# Altium project Projeto_DAC_Raspberry.PrjPcb (part 1 of 2)
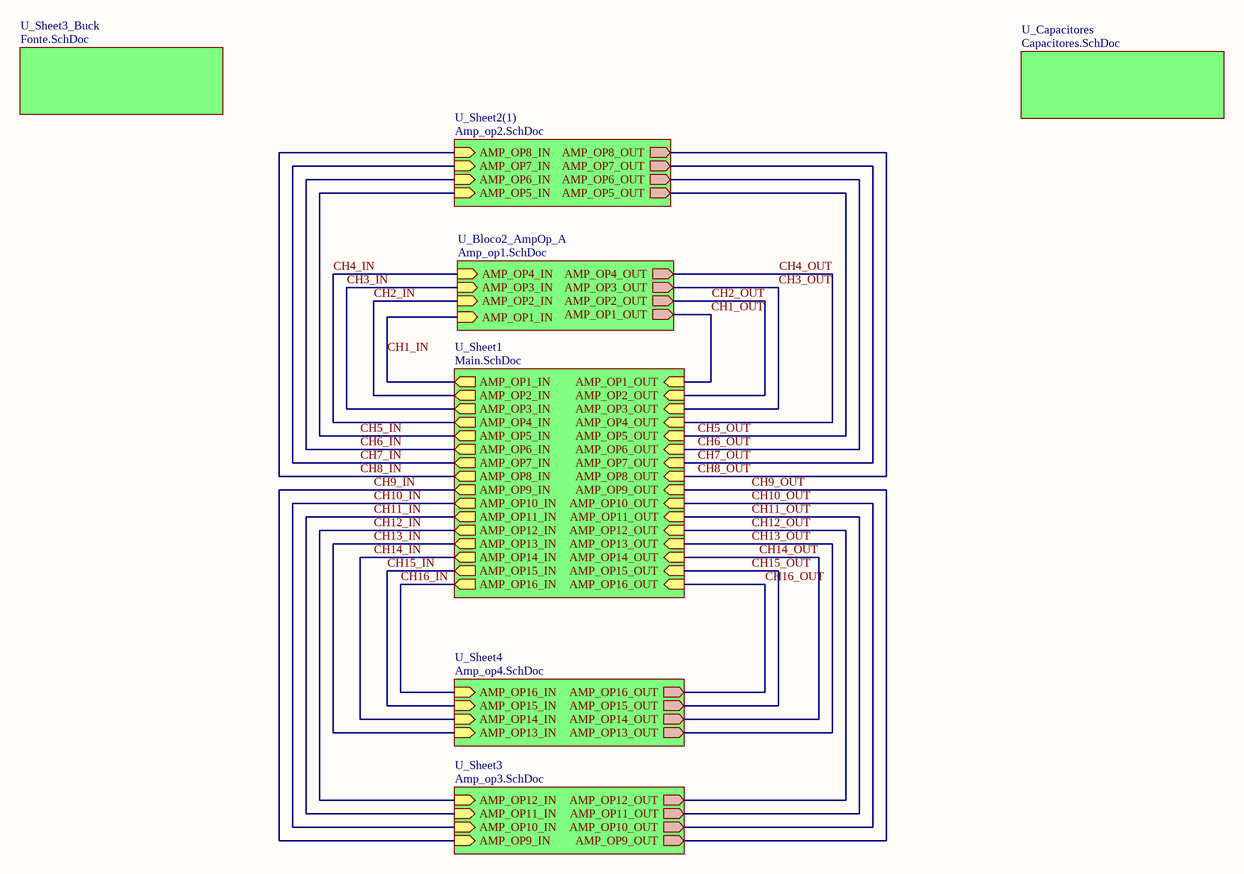
[diagram p0: Hierarquia.SchDoc]
8 sheets, 197 parts. Net scope: global (net labels, ports and power ports of the same name join across sheets).
Board file: RaspberryHatBoard1.PcbDoc
Sheets:
  Hierarquia.SchDoc
    U_Sheet3_Buck = fonte.SchDoc
    U_Bloco2_AmpOp_A = Amp_op1.SchDoc
    U_Sheet1 = Main.SchDoc
    U_Sheet2(1) = Amp_op2.SchDoc
    U_Sheet3 = Amp_op3.SchDoc
    U_Sheet4 = Amp_op4.SchDoc
    U_Capacitores = Capacitores.SchDoc

## Sheet Hierarquia.SchDoc: Hierarquia
size A3; Address1: UFCG; Address2: Laboratório VIRTUS CC; Address3: Campina Grande, PB - Brasil; SheetNumber: 1; SheetTotal: 8; Project: HAT RPi 4 - Phase Shifter Fotônico; DocumentRev: 01; Version: v1.0; SCH_SCALE: N/A

### Sub-sheets
U_Bloco2_AmpOp_A = Amp_op1.SchDoc: AMP_OP4_IN (in), AMP_OP3_IN (in), AMP_OP2_IN (in), AMP_OP1_IN (in), AMP_OP1_OUT (out), AMP_OP2_OUT (out), AMP_OP3_OUT (out), AMP_OP4_OUT (out)
U_Capacitores = Capacitores.SchDoc: no entries
U_Sheet1 = Main.SchDoc: AMP_OP1_IN (out), AMP_OP2_IN (out), AMP_OP3_IN (out), AMP_OP4_IN (out), AMP_OP1_OUT (in), AMP_OP2_OUT (in), AMP_OP3_OUT (in), AMP_OP4_OUT (in), AMP_OP5_IN (out), AMP_OP6_IN (out), AMP_OP7_IN (out), AMP_OP8_IN (out), AMP_OP5_OUT (in), AMP_OP6_OUT (in), AMP_OP7_OUT (in), AMP_OP8_OUT (in), AMP_OP9_IN (out), AMP_OP10_IN (out), AMP_OP11_IN (out), AMP_OP12_IN (out), AMP_OP13_IN (out), AMP_OP14_IN (out), AMP_OP15_IN (out), AMP_OP16_IN (out), AMP_OP9_OUT (in), AMP_OP10_OUT (in), AMP_OP11_OUT (in), AMP_OP12_OUT (in), AMP_OP13_OUT (in), AMP_OP14_OUT (in), AMP_OP15_OUT (in), AMP_OP16_OUT (in)
U_Sheet2(1) = Amp_op2.SchDoc: AMP_OP7_OUT (out), AMP_OP5_OUT (out), AMP_OP6_OUT (out), AMP_OP8_OUT (out), AMP_OP5_IN (in), AMP_OP6_IN (in), AMP_OP7_IN (in), AMP_OP8_IN (in)
U_Sheet3 = Amp_op3.SchDoc: AMP_OP9_OUT (out), AMP_OP10_OUT (out), AMP_OP12_OUT (out), AMP_OP9_IN (in), AMP_OP10_IN (in), AMP_OP11_IN (in), AMP_OP12_IN (in), AMP_OP11_OUT (out)
U_Sheet3_Buck = Fonte.SchDoc: no entries
U_Sheet4 = Amp_op4.SchDoc: AMP_OP16_OUT (out), AMP_OP13_OUT (out), AMP_OP15_OUT (out), AMP_OP14_OUT (out), AMP_OP13_IN (in), AMP_OP14_IN (in), AMP_OP15_IN (in), AMP_OP16_IN (in)

### Nets
CH1_IN: sheet U_Bloco2_AmpOp_A/AMP_OP1_IN, sheet U_Sheet1/AMP_OP1_IN
CH1_OUT: sheet U_Bloco2_AmpOp_A/AMP_OP1_OUT, sheet U_Sheet1/AMP_OP1_OUT
CH2_IN: sheet U_Bloco2_AmpOp_A/AMP_OP2_IN, sheet U_Sheet1/AMP_OP2_IN
CH2_OUT: sheet U_Bloco2_AmpOp_A/AMP_OP2_OUT, sheet U_Sheet1/AMP_OP2_OUT
CH3_IN: sheet U_Bloco2_AmpOp_A/AMP_OP3_IN, sheet U_Sheet1/AMP_OP3_IN
CH3_OUT: sheet U_Bloco2_AmpOp_A/AMP_OP3_OUT, sheet U_Sheet1/AMP_OP3_OUT
CH4_IN: sheet U_Bloco2_AmpOp_A/AMP_OP4_IN, sheet U_Sheet1/AMP_OP4_IN
CH4_OUT: sheet U_Bloco2_AmpOp_A/AMP_OP4_OUT, sheet U_Sheet1/AMP_OP4_OUT
CH5_IN: sheet U_Sheet1/AMP_OP5_IN, sheet U_Sheet2(1)/AMP_OP5_IN
CH5_OUT: sheet U_Sheet1/AMP_OP5_OUT, sheet U_Sheet2(1)/AMP_OP5_OUT
CH6_IN: sheet U_Sheet1/AMP_OP6_IN, sheet U_Sheet2(1)/AMP_OP6_IN
CH6_OUT: sheet U_Sheet1/AMP_OP6_OUT, sheet U_Sheet2(1)/AMP_OP6_OUT
CH7_IN: sheet U_Sheet1/AMP_OP7_IN, sheet U_Sheet2(1)/AMP_OP7_IN
CH7_OUT: sheet U_Sheet1/AMP_OP7_OUT, sheet U_Sheet2(1)/AMP_OP7_OUT
CH8_IN: sheet U_Sheet1/AMP_OP8_IN, sheet U_Sheet2(1)/AMP_OP8_IN
CH8_OUT: sheet U_Sheet1/AMP_OP8_OUT, sheet U_Sheet2(1)/AMP_OP8_OUT
CH9_IN: sheet U_Sheet1/AMP_OP9_IN, sheet U_Sheet3/AMP_OP9_IN
CH9_OUT: sheet U_Sheet1/AMP_OP9_OUT, sheet U_Sheet3/AMP_OP9_OUT
CH10_IN: sheet U_Sheet1/AMP_OP10_IN, sheet U_Sheet3/AMP_OP10_IN
CH10_OUT: sheet U_Sheet1/AMP_OP10_OUT, sheet U_Sheet3/AMP_OP10_OUT
CH11_IN: sheet U_Sheet1/AMP_OP11_IN, sheet U_Sheet3/AMP_OP11_IN
CH11_OUT: sheet U_Sheet1/AMP_OP11_OUT, sheet U_Sheet3/AMP_OP11_OUT
CH12_IN: sheet U_Sheet1/AMP_OP12_IN, sheet U_Sheet3/AMP_OP12_IN
CH12_OUT: sheet U_Sheet1/AMP_OP12_OUT, sheet U_Sheet3/AMP_OP12_OUT
CH13_IN: sheet U_Sheet1/AMP_OP13_IN, sheet U_Sheet4/AMP_OP13_IN
CH13_OUT: sheet U_Sheet1/AMP_OP13_OUT, sheet U_Sheet4/AMP_OP13_OUT
CH14_IN: sheet U_Sheet1/AMP_OP14_IN, sheet U_Sheet4/AMP_OP14_IN
CH14_OUT: sheet U_Sheet1/AMP_OP14_OUT, sheet U_Sheet4/AMP_OP14_OUT
CH15_IN: sheet U_Sheet1/AMP_OP15_IN, sheet U_Sheet4/AMP_OP15_IN
CH15_OUT: sheet U_Sheet1/AMP_OP15_OUT, sheet U_Sheet4/AMP_OP15_OUT
CH16_IN: sheet U_Sheet1/AMP_OP16_IN, sheet U_Sheet4/AMP_OP16_IN
CH16_OUT: sheet U_Sheet1/AMP_OP16_OUT, sheet U_Sheet4/AMP_OP16_OUT

### Notes on the sheet
- REVISION
- DESCRIPTION
- DATE
- APPROVED
- ADDRESS
- PROJECT
- VERSION
- TITLE
- A3
- SIZE
- SCALE
- DOCUMENT NAME:
- DOCUMENT REVISION:
- OF
- SHEET:
- PROJECT REVISION:

## Sheet fonte.SchDoc: Fonte
size A3; Address1: UFCG; Address2: Laboratório VIRTUS CC; Address3: Campina Grande, PB - Brasil; SheetNumber: 3; SheetTotal: 8; Project: HAT RPi 4 - Phase Shifter Fotônico; DocumentRev: 01; SCH_SCALE: N/A; Version: v1.0
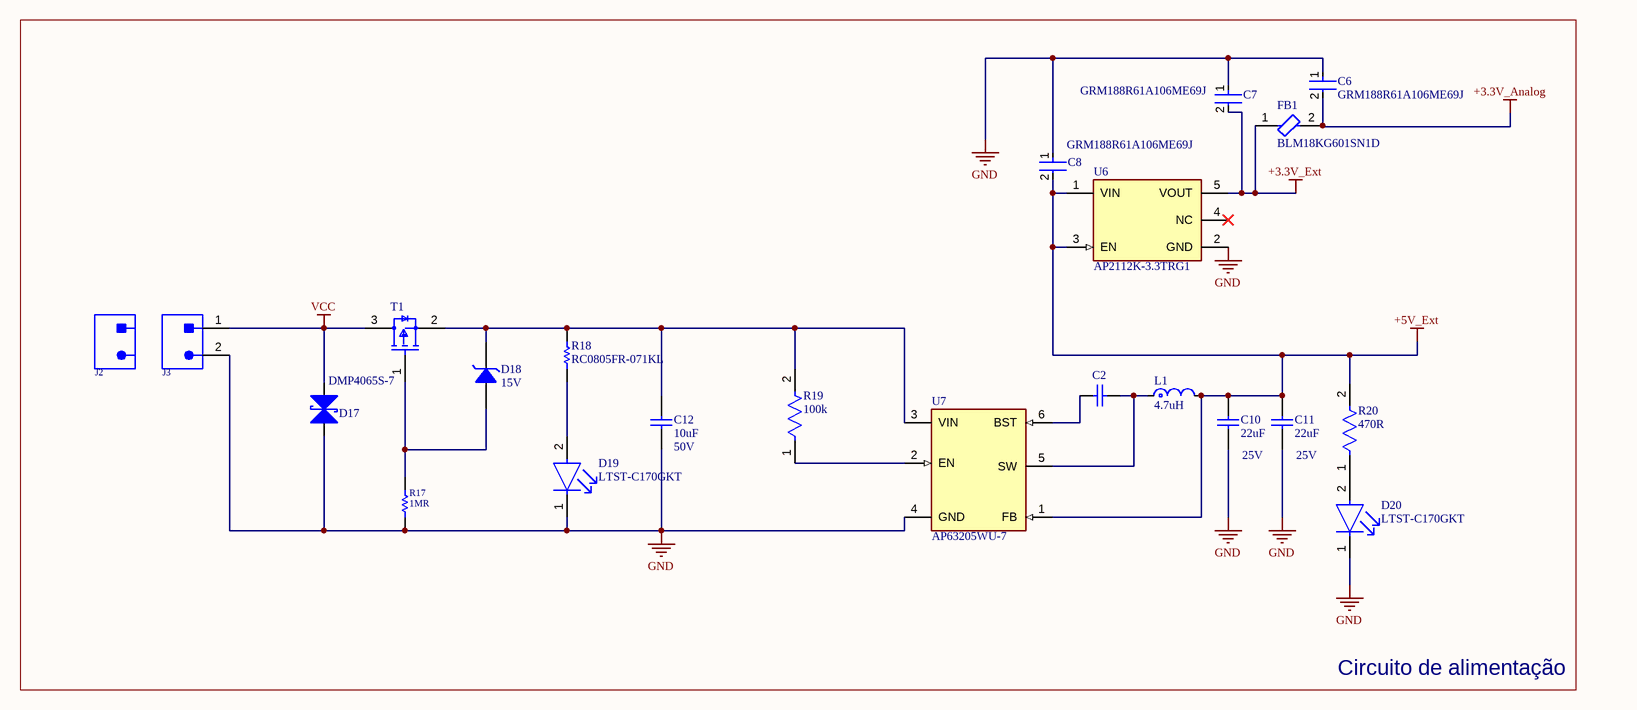
[diagram p1: fonte.SchDoc]

### Parts
C2  VJ0603Y104MXJCW1BC  [CAPC1608X95X40NL15T15]  (value not drawn)
C6  GRM188R61A106ME69J  [FP-GRM188-0_15-IPC_C]
C7  GRM188R61A106ME69J  [FP-GRM188-0_15-IPC_C]
C8  GRM188R61A106ME69J  [FP-GRM188-0_15-IPC_C]
C10  value 22uF  Voltage Rating (DC): 25V  [C-0805]  (hidden comment: CL21A226MAYNNNE)
C11  value 22uF  Voltage Rating: 25V  [C-0805]  (hidden comment: CL21A226MAYNNNE)
C12  value 10uF  Voltage Rating (DC): 50V  [C-1206]  (hidden comment: CL31A106KBHNNNE)
D17  SMBJ28CAQ-13-F  [DO-214AA]  (value not drawn)
D18  Zener Voltage: 15V  [SOD-123]  (hidden comment: MMSZ5245B-TP)
D19  LTST-C170GKT  [FP-LTST-C170GKT-MFG]
D20  LTST-C170GKT  [FP-LTST-C170GKT-MFG]
FB1  BLM18KG601SN1D  [FP-BLM18-0_15-t0_8-IPC_A]
J2  5447861  [5447861]  (value not drawn)
J3  5444262  [5444262]  (value not drawn)
L1  value 4.7uH  [FP-DG6045C-MFG]  (hidden comment: 1255AY-4R7M=P3)
R17  value 1MR  [R-0805]  (hidden comment: RC0805FR-071ML)
R18  RC0805FR-071KL  [RESC2013X60X35ML10T20]
R19  100k  [FP-CRGCQ0805-IPC_C]
R20  470R  [FP-CRGCQ0805-IPC_C]
T1  DMP4065S-7  [FP-SOT23-MFG]
U6  AP2112K-3.3TRG1  [FP-SOT25-IPC_A]
U7  AP63205WU-7  [TSOT-23-6_A]

### Blocks framed on the sheet
Circuito de alimentação: C2 C6-C8 C10-C12 D17-D20 FB1 J2 J3 L1 R17-R20 T1 U6 U7

### Nets
+3.3V_Analog: C6.2 FB1.2
+3.3V_Ext: C7.2 FB1.1 U6.5(VOUT)
+5V_Ext: C8.2 C10.1 C11.1 L1.2 R20.2 U6.1(VIN) U6.3(EN) U7.1(FB)
GND: C6.1 C7.1 C8.1 C10.2 C11.2 C12.2 D17.2(Anode) D19.1(C) D20.1(C) J3.2 R17.1 U6.2(GND) U7.4(GND)
VCC: D17.1(Cathode) J3.1 T1.3(D)
NetC2_1: C2.1 U7.6(BST)
NetC2_2: C2.2 L1.1 U7.5(SW)
NetC12_1: C12.1 D18.1(K) R18.2 R19.2 T1.2(S) U7.3(VIN)
NetD18_2: D18.2(A) R17.2 T1.1(G)
NetD19_2: D19.2(A) R18.1
NetD20_2: D20.2(A) R20.1
NetR19_1: R19.1 U7.2(EN)

Not connected (* = marked no-connect by the designer): U6 4(NC)*

### Notes on the sheet
- REVISION
- DESCRIPTION
- DATE
- APPROVED
- ADDRESS
- PROJECT
- VERSION
- TITLE
- A3
- SIZE
- SCALE
- DOCUMENT NAME:
- DOCUMENT REVISION:
- OF
- SHEET:
- PROJECT REVISION:

### Library data of the parts
C2 = CMP-2006-00058-1: Manufacturer: Vitramon; Part Number: VJ0603Y104MXJCW1BC
C6-C8 = CMP-06035-033844-1: Chip Multilayer Ceramic Capacitors for General Purpose, 0603, 10uF, X5R, 15%, 20%, 10V; Dielectric: X5R; Thickness: 800um; Tolerance: 20%; Length: 1.6mm; Voltage Rating (DC): 10V; Width: 800um; Capacitance: 10uF
C10 C11 = CL21A226MAYNNNE: CAP CER 22UF 25V X5R 0805; Manufacturer: Samsung; Material: 4241ConductorMaterial; Tolerance: 20%; Supplier: Digikey; Supplier Part Number: 1276-CL21A226MAYNNNECT-ND; Manufacturer Part Number: CL21A226MAYNNNE; RoHS: Yes; Category: Ceramic Capacitors; Stock: 120266; Pricing: 1=0,11, 10=0,066, 50=0,044, 100=0,043 (USD); Case/Package: 0805; Min Operating Temperature: -55°C; Max Operating Temperature: 85°C; Dielectric: X5R; Height: 1.45mm; RoHS Compliant: Yes; ComponentLink1URL: https://datasheet.octopart.com/CL21A226MAYNNNE-Samsung-Electro-Mechanics-datasheet-149154243.pdf?src-supplier=Future+Electronics; ComponentLink1Description: https://datasheet.octopart.com/CL21A226MAYNNNE-Samsung-Electro-Mechanics-datasheet-149154243.pdf?src-supplier=Future+Electronics; ComponentLink2URL: https://datasheet.octopart.com/CL21A226MAYNNNE-Samsung-datasheet-8326407.pdf?src-supplier=TME; ComponentLink2Description: https://datasheet.octopart.com/CL21A226MAYNNNE-Samsung-datasheet-8326407.pdf?src-supplier=TME; Supplier 1: Mouser; Supplier Part Number 1: 187-CL21A226MAYNNNE; Supplier 2: Digikey; Supplier Part Number 2: 1276-CL21A226MAYNNNECT-ND
  C10: Voltage Rating: 25V
  C11: Voltage Rating (DC): 25V
C12 = CL31A106KBHNNNE: CAP CER 10UF 50V X5R 1206; Manufacturer: Samsung; Material: Ceramic; Tolerance: 10%; Supplier: Digikey; Supplier Part Number: 1276-2876-1-ND; Manufacturer Part Number: CL31A106KBHNNNE; RoHS: Yes; Category: Ceramic Capacitors; Stock: 133875; Pricing: 1=0,11, 10=0,07 (USD); Mounting Technology: Surface Mount; Case/Package: 1206; Case Code (Metric): 3216; Case Code (Imperial): 1206; Min Operating Temperature: -55°C; Max Operating Temperature: 85°C; Package Quantity: 1; Packaging: Tape and Reel; Voltage Rating: 50V; Dielectric: X5R; Series: CL; Construction: Flat; Length: 3.2mm; Width: 0.063inch; Height: 1.6mm; Thickness: 0.071inch; Depth: 1.6mm; Radiation Hardening: No; Lead Free: Lead Free; RoHS Compliant: Yes; ComponentLink1URL: https://datasheet.ciiva.com/25726/cl31a106kbhnnne-25726404.pdf?src-supplier=Digikey; ComponentLink1Description: https://datasheet.ciiva.com/25726/cl31a106kbhnnne-25726404.pdf?src-supplier=Digikey; ComponentLink2URL: https://datasheet.ciiva.com/15216/getdatasheetpartid-353196-15216238.pdf?src-supplier=Verical; ComponentLink2Description: https://datasheet.ciiva.com/15216/getdatasheetpartid-353196-15216238.pdf?src-supplier=Verical; ComponentLink3URL: https://datasheet.ciiva.com/29201/452492-da-01-en-vs-kondensator-1206-29201107.pdf?src-supplier=Conrad; ComponentLink3Description: https://datasheet.ciiva.com/29201/452492-da-01-en-vs-kondensator-1206-29201107.pdf?src-supplier=Conrad; ComponentLink4URL: https://datasheet.ciiva.com/16437/cl05b104kq5nnnc-16437222.pdf?src-supplier=Future+Electronics; ComponentLink4Description: https://datasheet.ciiva.com/16437/cl05b104kq5nnnc-16437222.pdf?src-supplier=Future+Electronics; Supplier 1: Mouser; Supplier Part Number 1: 187-CL31A106KBHNNNE; Supplier 2: Digikey; Supplier Part Number 2: 1276-2876-2-ND
D17 = SMBJ28CAQ-13-F: TVS DIODE 28VWM 45.4VC SMB; Manufacturer: Diodes; Number of Bidirectional Channels: 1; Reverse Standoff Voltage: 28V; Min Breakdown Voltage: 31.1V; Clamping Voltage: 45.4V; Peak Pulse Current: 13.2A; Peak Pulse Power: 600W; Power Line Protection: No; Supplier 1: Digi-Key; Manufacturer Part Number: SMBJ28CAQ-13-F; RoHS: Yes; Category: TVS Diodes; Stock 1: 16278; Pricing 1: 1=0,44000, 10=0,37900, 100=0,28310, 500=0,22240, 1000=0,17185 (USD); Mount: Surface Mount; Case/Package: SMB; Min Operating Temperature: -55°C; Max Operating Temperature: 150°C; Resistor Type: Zener; Packaging: Tape and Reel; RoHS Compliant: Yes; ComponentLink1URL: https://www.diodes.com/assets/Datasheets/ds40740.pdf?src-supplier=Digi-Key; ComponentLink1Description: https://www.diodes.com/assets/Datasheets/ds40740.pdf?src-supplier=Digi-Key; Supplier 2: Mouser; Supplier Part Number 2: 621-SMBJ28CAQ-13-F; Supplier Part Number 1: SMBJ28CAQ-13-FDICT-ND
D18 = MMSZ5245B-TP: DIODE ZENER 15V 500MW SOD123; Manufacturer: MCC; Tolerance: 5%; Impedance: 16R; Max Reverse Leakage Current: 100nA; Test Current: 8.5mA; Element Configuration: Single; Supplier 1: Digi-Key; Manufacturer Part Number: MMSZ5245B-TP; RoHS: Yes; Category: Zener Diodes; Stock 1: 330368; Pricing 1: 1=0,22000, 10=0,17700, 100=0,09400, 500=0,06188, 1000=0,04208 (USD); Mount: Surface Mount; Number of Pins: 2; Min Operating Temperature: -55°C; Max Operating Temperature: 150°C; Packaging: Tape and Reel; Package Quantity: 1; Max Power Dissipation: 500mW; Power Dissipation: 500mW; Voltage Tolerance: 5%; Series: -; Lead Free: Lead Free; ComponentLink1URL: https://datasheet.ciiva.com/890/mmsz5221-mmsz5259sod123-890445.pdf?src-supplier=Digi-Key; ComponentLink1Description: https://datasheet.ciiva.com/890/mmsz5221-mmsz5259sod123-890445.pdf?src-supplier=Digi-Key; ComponentLink2URL: https://datasheet.ciiva.com/890/mmsz5221-mmsz5259sod123-890446.pdf?src-supplier=Digi-Key; ComponentLink2Description: https://datasheet.ciiva.com/890/mmsz5221-mmsz5259sod123-890446.pdf?src-supplier=Digi-Key; ComponentLink3URL: https://datasheet.ciiva.com/890/mmsz5221-mmsz5259sod123-890447.pdf?src-supplier=Digi-Key; ComponentLink3Description: https://datasheet.ciiva.com/890/mmsz5221-mmsz5259sod123-890447.pdf?src-supplier=Digi-Key; Supplier 2: Mouser; Supplier 3: Arrow Electronics; Supplier Part Number 1: MMSZ5245B-TPMSCT-ND; Supplier Part Number 2: 833-MMSZ5245B-TP; Supplier Part Number 3: MMSZ5245B-TP
D19 D20 = CMP-1674-00002-6: LED GREEN CLEAR SMD; Dominant Wavelength: 569nm; Lens Style: Diffused; Forward Voltage: 2.1V; Number of Elements: 1; Wavelength: 565nm; Luminous Intensity: 6mcd; Test Current: 10mA; Power Dissipation: 100mW; Reverse Voltage: 5V; Forward Current: 30mA; Viewing Angle: 130°; Lens Color: Colorless; Min Operating Temperature: -55°C; Number of Pins: 2; Max Operating Temperature: 85°C; Color: Green; Radiation Hardening: No; Illumination Color: Green; Case Code (Metric): 2012; Lens Transparency: Clear; Case/Package: 0805; Width: 1.25mm; Case Code (Imperial): 0805; Package Quantity: 1; Height: 1.1mm; Depth: 1.25mm; Length: 2mm; Power Rating: 100mW; Lead Free: Lead Free; Number of LEDs: 1; Packaging: Tape and Reel; Mount: Surface Mount; Voltage: 5V
FB1 = CMP-0686-00581-3: Chip Ferrite Bead, 0603, 600Ω @ 100MHz, 0.15Ω, 25%, 1.3A; Material: Steel; Number of Lines: 1; Impedance: 600R; DC Resistance (DCR): 150mR; Tolerance: 25%; Case Code (Metric): 1608; Width: 0.8mm; DC Current: 1.3A; Max DC Current: 1.3A; Package Quantity: 1; Number of Pins: 2; Military Standard: Not; RoHS Compliant: Yes; Termination: SMD/SMT; Max Operating Temperature: 125°C; Length: 1.6mm; Depth: 0.8mm; Case Code (Imperial): 0603; Series: BLM18K; Inductor Type: FERRITE BEAD; Core Material: Ferrite; Number of Circuits: 1; Height: 0.8mm; Case/Package: 0603; REACH SVHC: No SVHC; Packaging: Tape and Reel; Min Operating Temperature: -55°C; Max Current Rating: 1.3A; Radiation Hardening: No; Current Rating: 1.3A; Lead Free: Lead Free; Test Frequency: 100MHz; Weight: 7.1E-05oz
J2 = 5447861: TERM BLOCK PLUG 2POS STR 3.81MM; Manufacturer: Phoenix Contact; Current Rating: 8A; Voltage Rating: 160V; Number of Positions: 2; Number of Levels: 1; Connector Type: Screw; Voltage: 300V; Wire Gauge (Max): 30AWG; Wire Gauge (Min): 14AWG; Pitch: 0.15inch; Supplier 1: Digi-Key; Manufacturer Part Number: 5447861; RoHS: Yes; Category: Terminal Blocks; Stock 1: 30203; Pricing 1: 1=2,56000, 10=2,45300, 50=2,38620, 100=2,23000, 250=2,05160, 500=1,89550, 1000=1,80631, 2500=1,77954 (USD); Mount: Free Hanging; Number of Pins: 2; Color: Green; Contact Plating: Tin; Housing Material: Polyamide; Package Quantity: 100; Packaging: Bulk; Number of Positions Per Level: 2; Termination: Screw; Current: 8A; Flammability Rating: UL94 V-0; ComponentLink1URL: https://datasheet.ciiva.com/29706/5447861-29706032.pdf?src-supplier=Digi-Key; ComponentLink1Description: https://datasheet.ciiva.com/29706/5447861-29706032.pdf?src-supplier=Digi-Key; Supplier 2: Mouser; Supplier Part Number 1: 277-11343-ND; Supplier Part Number 2: 651-5447861; JLCPCB Part: *
J3 = 5444262: TERM BLOCK HDR 2POS 90DEG 3.81MM; Manufacturer: Phoenix Contact; Current Rating: 8A; Voltage Rating: 160V; Number of Positions: 2; Number of Levels: 1; Voltage: 300V; Pitch: 0.15inch; Supplier 1: Digi-Key; Manufacturer Part Number: 5444262; RoHS: Yes; Category: Terminal Blocks; Stock 1: 66186; Pricing 1: 1=0,87000, 10=0,83600, 50=0,81320, 100=0,76000, 250=0,69920, 500=0,64600, 1000=0,61560, 2500=0,60648 (USD); Mount: Through Hole; Contact Plating: Tin; Color: Green; Housing Material: Polyamide; Packaging: Bulk; Termination: Solder; Package Quantity: 100; Number of Positions Per Level: 2; Current: 8A; Length: 9.2mm; RoHS Compliant: Yes; Flammability Rating: UL94 V-0; ComponentLink1URL: https://datasheet.ciiva.com/29682/5444262-29682658.pdf?src-supplier=Digi-Key; ComponentLink1Description: https://datasheet.ciiva.com/29682/5444262-29682658.pdf?src-supplier=Digi-Key; Supplier 2: Mouser; Supplier Part Number 2: 651-5444262; Supplier Part Number 1: 277-11313-ND; JLCPCB Part: *
L1 = 1255AY-4R7M=P3: FIXED IND 4.7UH 4A 23 MOHM SMD; Manufacturer: Murata; Core Material: Ferrite; Current Rating: 4.5A; Shielding: Shielded; DC Resistance (DCR): 27.6mR; Test Frequency: 100kHz; Tolerance: 20%; Supplier: Digikey; Supplier Part Number: 490-10812-1-ND; Manufacturer Part Number: 1255AY-4R7M=P3; RoHS: Yes; Category: Fixed Inductors; Stock: 84053; Pricing: 1=0,38, 10=0,314, 100=0,2584 (USD); Mounting Technology: Surface Mount; Case/Package: Nonstandard; Min Operating Temperature: -40°C; Max Operating Temperature: 85°C; Packaging: Cut Tape; Series: DG6045C; Inductance Tolerance: 20%; RMS Current (Irms): 4A; ESR: 27.6mR; Length: 0.248inch; Width: 0.248inch; Height: 4.5mm; Height - Seated (Max): 0.177inch; RoHS Compliant: Yes; ComponentLink1URL: http://search.murata.co.jp/Ceramy/image/img/P02/J(E)TE243B-0037_DG6045C_reference.pdf?src-supplier=Digikey; ComponentLink1Description: http://search.murata.co.jp/Ceramy/image/img/P02/J(E)TE243B-0037_DG6045C_reference.pdf?src-supplier=Digikey; ComponentLink2URL: http://www.toko.co.jp/products/pdf/inductors/dg6045c.pdf?src-supplier=Digikey; ComponentLink2Description: http://www.toko.co.jp/products/pdf/inductors/dg6045c.pdf?src-supplier=Digikey; ComponentLink3URL: http://www.toko.co.jp/products/pdf/inductors/dg6045c.pdf?src-supplier=Avnet; ComponentLink3Description: http://www.toko.co.jp/products/pdf/inductors/dg6045c.pdf?src-supplier=Avnet; Saturation Current: 4.5A
R17 = RC0805FR-071ML: RES 1M OHM 1% 1/8W 0805; Manufacturer: Yageo; Voltage Rating: 150V; Power Rating: 125mW; Temperature Coefficient: 250ppm/°C; Supplier: Digikey; Supplier Part Number: 311-1.00MCRCT-ND; Manufacturer Part Number: RC0805FR-071ML; RoHS: Yes; Category: Chip SMD Resistors; Stock: 145027; Pricing: 1=0,1, 10=0,026, 50=0,0162, 100=0,0134, 500=0,00906, 1000=0,00778 (USD); Case/Package: Molded; Case Code (Imperial): 0805; Case Code (Metric): 2012; Min Operating Temperature: -55°C; Max Operating Temperature: 155°C; Packaging: Tape and Reel; Tolerance: 1%; Resistor Type: Thick Film; Construction: Rectangular; Resistance Tolerance: 1%; Voltage Rating (AC): 150V; Length: 2mm; Depth: 1.25mm; RoHS Compliant: Yes; Reach SVHC Compliant: Unknown; Military Standard: Not; Lead Free: Lead Free; Supplier 1: Digikey; Supplier Part Number 1: 311-1.00MCRCT-ND; Supplier 2: Mouser; Supplier Part Number 2: 603-RC0805FR-071ML; ComponentLink1URL: https://datasheet.ciiva.com/17419/rc0805-17419909.pdf?src-supplier=Future+Electronics; ComponentLink1Description: https://datasheet.ciiva.com/17419/rc0805-17419909.pdf?src-supplier=Future+Electronics
R18 = CMP-2100-03671-1: Chip Resistor, 1 KOhm, +/- 1%, 125 mW, -55 to 155 degC, 0805 (2012 Metric), RoHS, Tape and Reel; Manufacturer: Yageo; Temperature Coefficient: 100ppm/degreesC; Voltage Rating (DC): 150V; Max Power Dissipation: 125mW; Resistance: 1KOhm; Number of Pins: 2; Number of Terminations: 2; Datasheet URL: http://www.yageo.com/NewPortal/yageodocoutput?fileName=/pdf/R-Chip/PYu-RC_Group_51_RoHS_L_5.pdf; Length: 0.079inch; Package Description: 2-Pin Surface Mounted Device, Body 2 x 1.25 mm; Depth: 1.25mm; Height: 0.024inch; Military Standard: Not; Case/Package: 0805; Package Reference: 0805; RoHSCompliant: true; Lead Free: LeadFree; Packaging: TapeandReel; Package Quantity: 1; Datasheet Version: Rev. 5, 10/2016; Tolerance: 1%; Min Operating Temperature: -55degC; Voltage Rating: 150V; Composition: ThickFilm; Case Code (Imperial): 0805; Power Rating: 125mW; Width: 0.049inch; Case Code (Metric): 2012; Manufacturer URL: http://www.yageo.com/; Max Operating Temperature: 155degC; REACH SVHC: Unknown; Termination: SMD/SMT
R19 = CMP-03211-000816-1: CRGCQ 0805 100K 1%; Manufacturer: TE Connectivity; Manufacturer Part Number: CRGCQ0805F100K; Tolerance: 0.01; Power Rating: 0.125W; Resistance: 100KΩ; Value: 100KΩ; Temperature Coefficient: ±100ppm/°C; Voltage Rating: 150V; RoHS: TRUE; ComponentLink2URL: https://www.te.com/commerce/DocumentDelivery/DDEController?Action=showdoc&DocId=Data+Sheet%7F1773204-3%7F1%7Fpdf%7FEnglish%7FENG_DS_1773204-3_1.pdf%7F4-2176341-1150; Category: Res; Device Class L2: Resistors; Height: 0.65mm; Ambient Temperature Range High: +70°C; Ipc Land Pattern Name: RESC200125X55; Octopart: https://octopart.com/crgcq0805f100k-te+connectivity-91018138; Digikey Description: CRGCQ 0805 100K 1%; Temperature Range High: +155°C; Lead Free: Yes; Automotive: Yes; Temperature Range Low: -55°C; Device Class L1: Passive Components; Device Class L3: Chip SMD Resistors; Mouser Description: Res Thick Film 0805 100K Ohm 1% 0.125W(1/8W) ±100ppm/C Pad SMD Automotive T/R; Temperature: -55°C to +155°C; Composition: Thick Film; ComponentLink2Description: Datasheet; Automotive Grade: Grade 1141; Package: CRGCQ0805; Series: CRGCQ
R20 = CMP-03211-002267-1: CRGCQ0805 470Ω 0.125W ±100ppm/°C 5% 150V; Manufacturer: TE Connectivity; Manufacturer Part Number: CRGCQ0805J470R; Tolerance: 0.05; Automotive Grade: Grade 610; Temperature Range Low: -55°C; Power Rating: 0.125W; Temperature: -55°C to +155°C; Height: 0.65mm; Temperature Coefficient: ±100ppm/°C; Resistance: 470Ω; Composition: Thick Film; Ambient Temperature Range High: +70°C; Category: Res; Value: 470Ω; Automotive: Yes; Series: CRGCQ; Package: CRGCQ0805; Device Class L3: Chip SMD Resistors; ComponentLink2URL: https://www.te.com/commerce/DocumentDelivery/DDEController?Action=showdoc&DocId=Data+Sheet%7F1773204-3%7F1%7Fpdf%7FEnglish%7FENG_DS_1773204-3_1.pdf%7F4-2176341-619; Device Class L2: Resistors; Octopart: https://octopart.com/crgcq0805j470r-te+connectivity-91018229; Voltage Rating: 150V; Ipc Land Pattern Name: RESC200125X55; Temperature Range High: +155°C; Device Class L1: Passive Components; ComponentLink2Description: Datasheet; RoHS: TRUE; Lead Free: Yes
T1 = CMP-12801-000050-1: MOSFET P-CH 40V 2.4A SOT23; Manufacturer: Diodes Inc.; Number Of Channels: 1; Max Junction Temp: +150°C; Standoff Height: 0.013mm; Power Dissipation: 0.72W; Turn Off Delay Time: 36.3ns; Rthja Max: 171°C/W; Typ Forward Diode Voltage: -0.7V; Max Forward Diode Voltage: -1.2V; Drain To Source Voltage: -40V; Threshold Vgs Min: -1V; Gate To Source Voltage: 20V; Depletion Mode: False; Input Capacitace At Vds: 587pF @ -20V; Drain To Source Resistance: 64mΩ; Turn On Delay Time: 3.6ns; Continuous Drain Current: -2.4A; Pulse Drain Current: -20A; Gate Charge At Vgs: 12.2nC @ -10V; Threshold Vgs Max: -3V; Octopart: https://octopart.com/dmp4065s-7-diodes+inc.-57605044; Footprint Url: https://www.diodes.com/assets/Package-Files/SOT23.pdf; Device Class L2: Transistors; Package: SOT23; Number Of P Channels: 1; ComponentLink2URL: https://www.diodes.com/assets/Datasheets/DMP4065S.pdf; Temperature Range High: +150°C; Device Class L1: Discrete Semiconductors; Temperature Range Low: -55°C; Manufacturer Part Number: DMP4065S-7; ComponentLink2Description: Datasheet; Lead Free: Yes; Temperature: -55°C to +150°C; Drain To Source Breakdown Voltage: -40V; Category: Trans; Height: 1.1mm; Digikey Description: MOSFET P-CH 40V 2.4A SOT23; Ipc Land Pattern Name: SOT92P240X102-3; Device Class L3: MOSFETs; RoHS: TRUE; Mouser Description: Trans MOSFET P-CH 40V 2.4A Automotive 3-Pin SOT-23 T/R; Automotive: No
U6 = CMP-12756-000035-1: IC REG LINEAR 3.3V 600MA SOT25; Number of Regulators: 1; Output Type: Fixed; Polarity: Positive; Min Input Voltage: 2.5V; Max Input Voltage: 6V; Accuracy: 1.5%; Quiescent Current: 55uA; Dropout Voltage: 250mV; Min Operating Temperature: -40°C; Length: 3.1mm; Output Current: 600mA; Max Operating Temperature: 85°C; Package Quantity: 1; Output Voltage: 3.3V; Width: 1.7mm; Number of Outputs: 1; Packaging: Tape and Reel; Height: 1.3mm; Lead Free: Lead Free; Max Output Current: 600mA; Case/Package: SOT-23-5; Mount: Surface Mount; Number of Pins: 5
U7 = AP63205WU-7: IC REG BUCK 5V 2A TSOT23-6; Manufacturer: Diodes; Max Duty Cycle: 100%; Max Supply Voltage: 32V; Min Supply Voltage: 3.8V; Nominal Supply Current: 22uA; Number of Outputs: 1; Switching Frequency: 1.1MHz; Supplier: Digikey; Supplier Part Number: AP63205WU-7DICT-ND; Manufacturer Part Number: AP63205WU-7; RoHS: Yes; Category: Voltage Regulators - Switching; Stock: 6143; Pricing: 1=0,71, 10=0,506, 25=0,4548, 100=0,398, 250=0,37088, 500=0,35456, 1000=0,34112 (USD); Min Operating Temperature: -40°C; Max Operating Temperature: 85°C; Output Current: 2A; Output Voltage: 5V; Height: 1mm; ComponentLink1URL: https://www.diodes.com/assets/Datasheets/AP63200-AP63201-AP63203-AP63205.pdf?src-supplier=Digikey; ComponentLink1Description: https://www.diodes.com/assets/Datasheets/AP63200-AP63201-AP63203-AP63205.pdf?src-supplier=Digikey; Supplier 1: Digikey; Supplier Part Number 1: AP63205WU-7DICT-ND; Supplier 2: Mouser; Supplier Part Number 2: 621-AP63205WU-7

## Sheet Amp_op1.SchDoc: AmpOps de Potência
size A3; Address1: UFCG; Address2: Laboratório VIRTUS CC; Address3: Campina Grande, PB - Brasil; Revision: 01; SheetNumber: 4; SheetTotal: 8; Version: v1.0; Project: HAT RPi 4 - Phase Shifter Fotônico; SCH_SCALE: N/A; DocumentRev: 01
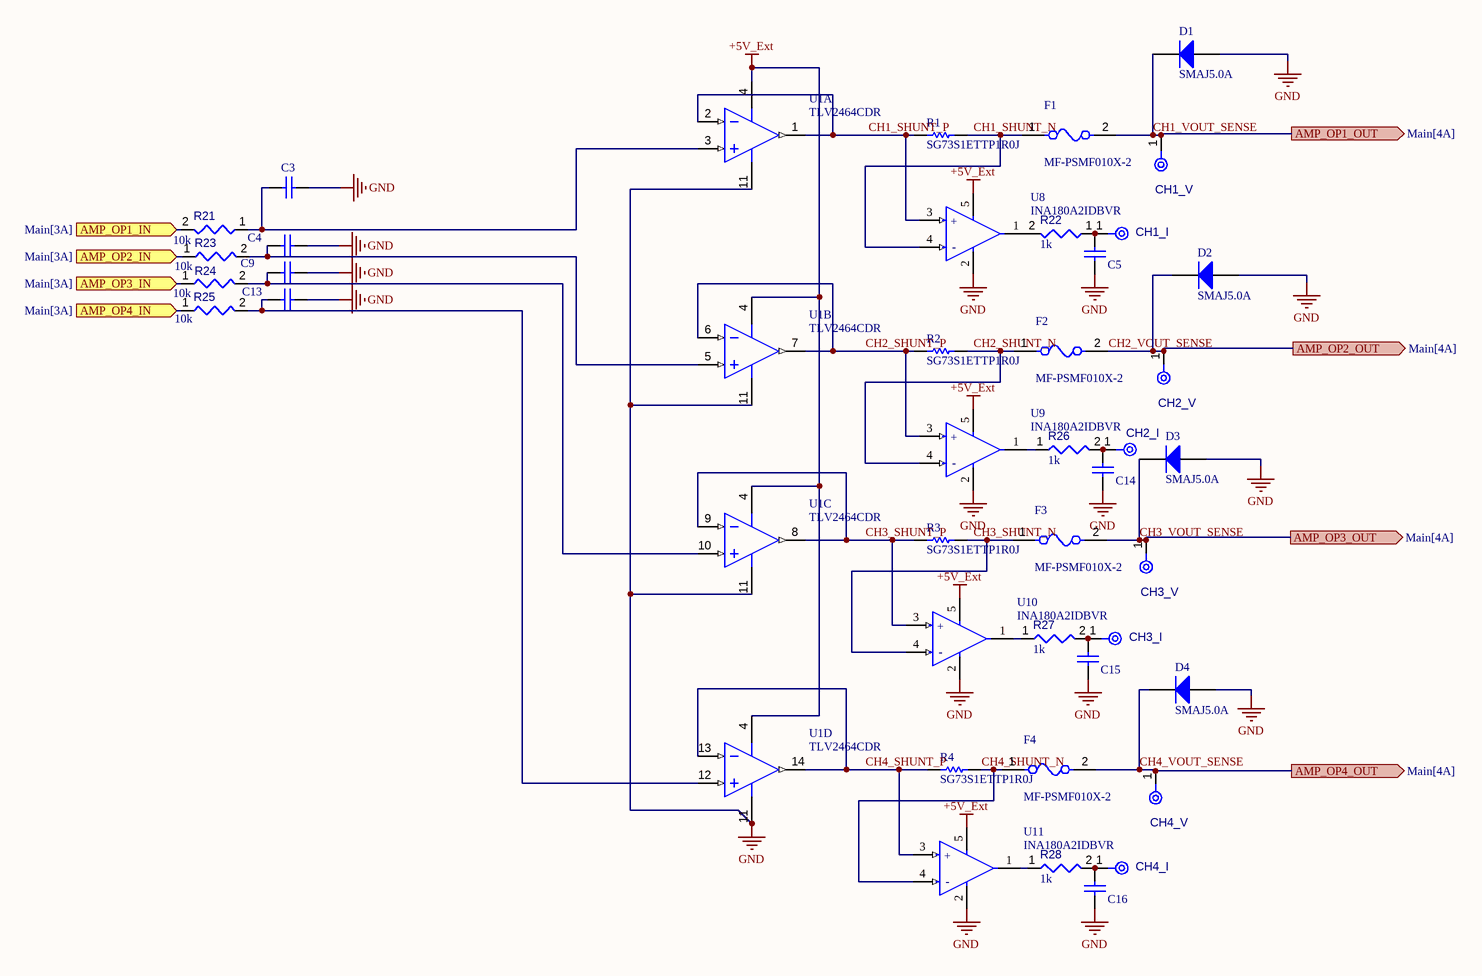
[diagram p2: Amp_op1.SchDoc]

### Parts
C3  VJ0603Y104MXJCW1BC  [CAPC1608X95X40NL15T15]  (value not drawn)
C4  VJ0603Y104MXJCW1BC  [CAPC1608X95X40NL15T15]  (value not drawn)
C5  VJ0603Y104MXJCW1BC  [CAPC1608X95X40NL15T15]  (value not drawn)
C9  VJ0603Y104MXJCW1BC  [CAPC1608X95X40NL15T15]  (value not drawn)
C13  VJ0603Y104MXJCW1BC  [CAPC1608X95X40NL15T15]  (value not drawn)
C14  VJ0603Y104MXJCW1BC  [CAPC1608X95X40NL15T15]  (value not drawn)
C15  VJ0603Y104MXJCW1BC  [CAPC1608X95X40NL15T15]  (value not drawn)
C16  VJ0603Y104MXJCW1BC  [CAPC1608X95X40NL15T15]  (value not drawn)
CH1_I  TPAD6R  [TP06R]  (value not drawn)  (no BOM)
CH1_V  TPAD6R  [TP06R]  (value not drawn)  (no BOM)
CH2_I  TPAD6R  [TP06R]  (value not drawn)  (no BOM)
CH2_V  TPAD6R  [TP06R]  (value not drawn)  (no BOM)
CH3_I  TPAD6R  [TP06R]  (value not drawn)  (no BOM)
CH3_V  TPAD6R  [TP06R]  (value not drawn)  (no BOM)
CH4_I  TPAD6R  [TP06R]  (value not drawn)  (no BOM)
CH4_V  TPAD6R  [TP06R]  (value not drawn)  (no BOM)
D1  SMAJ5.0A  [BOUR-SMA-2_V]
D2  SMAJ5.0A  [BOUR-SMA-2_V]
D3  SMAJ5.0A  [BOUR-SMA-2_V]
D4  SMAJ5.0A  [BOUR-SMA-2_V]
F1  MF-PSMF010X-2  [FP-MF-PSMF-MFG]
F2  MF-PSMF010X-2  [FP-MF-PSMF-MFG]
F3  MF-PSMF010X-2  [FP-MF-PSMF-MFG]
F4  MF-PSMF010X-2  [FP-MF-PSMF-MFG]
R1  SG73S1ETTP1R0J  [RESC1005X40X25LL10T10]
R2  SG73S1ETTP1R0J  [RESC1005X40X25LL10T10]
R3  SG73S1ETTP1R0J  [RESC1005X40X25LL10T10]
R4  SG73S1ETTP1R0J  [RESC1005X40X25LL10T10]
R21  value 10k  [RESC0603(1608)_L]  (hidden comment: Resistor 10k +/-1% 0603 100 mW)
R22  value 1k  [RESC0603(1608)_L]  (hidden comment: Resistor 1k +/-1% 0603 100 mW)
R23  value 10k  [RESC0603(1608)_L]  (hidden comment: Resistor 10k +/-1% 0603 100 mW)
R24  value 10k  [RESC0603(1608)_L]  (hidden comment: Resistor 10k +/-1% 0603 100 mW)
R25  value 10k  [RESC0603(1608)_L]  (hidden comment: Resistor 10k +/-1% 0603 100 mW)
R26  value 1k  [RESC0603(1608)_L]  (hidden comment: Resistor 1k +/-1% 0603 100 mW)
R27  value 1k  [RESC0603(1608)_L]  (hidden comment: Resistor 1k +/-1% 0603 100 mW)
R28  value 1k  [RESC0603(1608)_L]  (hidden comment: Resistor 1k +/-1% 0603 100 mW)
U1  TLV2464CDR  [D0014A_N]  (parts A,B,C,D of 4)
U8  INA180A2IDBVR  [FP-DBV0005A-MFG]
U9  INA180A2IDBVR  [FP-DBV0005A-MFG]
U10  INA180A2IDBVR  [FP-DBV0005A-MFG]
U11  INA180A2IDBVR  [FP-DBV0005A-MFG]

### Ports
AMP_OP1_IN (in, see Main[3A]), AMP_OP1_OUT (out, see Main[4A]), AMP_OP2_IN (in, see Main[3A]), AMP_OP2_OUT (out, see Main[4A]), AMP_OP3_IN (in, see Main[3A]), AMP_OP3_OUT (out, see Main[4A]), AMP_OP4_IN (in, see Main[3A]), AMP_OP4_OUT (out, see Main[4A])

### Nets
+5V_Ext: U1.4(VDD+) U8.5(VS) U9.5(VS) U10.5(VS) U11.5(VS)
GND: C3.2 C4.2 C5.1 C9.2 C13.2 C14.2 C15.2 C16.2 D1.1(A) D2.1(A) D3.1(A) D4.1(A) U1.11(GND) U8.2(GND) U9.2(GND) U10.2(GND) U11.2(GND)
CH1_SHUNT_N: F1.1 R1.2 U8.4(IN-)
CH1_SHUNT_P: R1.1 U1.1(OUT1) U1.2(IN1-) U8.3(IN+)
CH1_VOUT_SENSE: CH1_V.1(TP) D1.2(K) F1.2 ; port AMP_OP1_OUT
CH2_SHUNT_N: F2.1 R2.2 U9.4(IN-)
CH2_SHUNT_P: R2.1 U1.6(IN2-) U1.7(OUT2) U9.3(IN+)
CH2_VOUT_SENSE: CH2_V.1(TP) D2.2(K) F2.2 ; port AMP_OP2_OUT
CH3_SHUNT_N: F3.1 R3.2 U10.4(IN-)
CH3_SHUNT_P: R3.1 U1.8(OUT3) U1.9(IN3-) U10.3(IN+)
CH3_VOUT_SENSE: CH3_V.1(TP) D3.2(K) F3.2 ; port AMP_OP3_OUT
CH4_SHUNT_N: F4.1 R4.2 U11.4(IN-)
CH4_SHUNT_P: R4.1 U1.13(IN4-) U1.14(OUT4) U11.3(IN+)
CH4_VOUT_SENSE: CH4_V.1(TP) D4.2(K) F4.2 ; port AMP_OP4_OUT
NetC3_1: C3.1 R21.1 U1.3(IN1+)
NetC4_1: C4.1 R23.2 U1.5(IN2+)
NetC5_2: C5.2 CH1_I.1(TP) R22.1
NetC9_1: C9.1 R24.2 U1.10(IN3+)
NetC13_1: C13.1 R25.2 U1.12(IN4+)
NetC14_1: C14.1 CH2_I.1(TP) R26.2
NetC15_1: C15.1 CH3_I.1(TP) R27.2
NetC16_1: C16.1 CH4_I.1(TP) R28.2
NetR21_2: R21.2 ; port AMP_OP1_IN
NetR22_2: R22.2 U8.1(OUT)
NetR23_1: R23.1 ; port AMP_OP2_IN
NetR24_1: R24.1 ; port AMP_OP3_IN
NetR25_1: R25.1 ; port AMP_OP4_IN
NetR26_1: R26.1 U9.1(OUT)
NetR27_1: R27.1 U10.1(OUT)
NetR28_1: R28.1 U11.1(OUT)

### Notes on the sheet
- REVISION
- DESCRIPTION
- DATE
- APPROVED
- ADDRESS
- PROJECT
- VERSION
- TITLE
- A3
- SIZE
- SCALE
- DOCUMENT NAME:
- DOCUMENT REVISION:
- OF
- SHEET:
- PROJECT REVISION:
- (in symbol CMP-04895-000287-1) +; -

### Library data of the parts
C3-C5 C9 C13-C16 = CMP-2006-00058-1: Manufacturer: Vitramon; Part Number: VJ0603Y104MXJCW1BC
CH1_I CH1_V CH2_I CH2_V CH3_I CH3_V CH4_I CH4_V = CMP-00028-00002-2: 0.6mm round; Pins: 1; Component Type: Mechanical
D1-D4 = CMP-2000-07090-1: SMAJ Transient Voltage Suppressor Diode Series, 3.5 V, -55 to 150 degC, 2-Pin SMA, RoHS, Tape and Reel; Manufacturer: Bourns; EDA / CAD Models: DownloadfromAcceleratedDesigns; Unidirectional Channels: 1; Voltage - Breakdown (Min): 6.4V; Voltage - Reverse Standoff (Typ): 5V; Voltage - Clamping (Max) @ Ipp: 9.2V; Other Names: SMAJ5.0ABDKR; Type: Zener; Catalog Drawings: SMAJSeriesFootprintSMAJ,SMBJSeries; Featured Product: SMAJ/SMBJ/SMCJ/SMLJDiscreteTVSDiodes; Power - Peak Pulse: 400W; Current - Peak Pulse (10/1000µs): 43.5A; Power Line Protection: No; Online Catalog: SMAJSeries; Supplier Device Package: SMA(DO-214AC); Operating Temperature: -55°C~150°C(TJ); Package Description: 2-Pin Surface Mount Device, Body 4.315 x 2.605 mm; Datasheet URL: https://datasheet.ciiva.com/25624/0900766b8112213b-25624680.pdf; Manufacturer URL: http://www.bourns.com/; Datasheet Version: 08/2012; Series: SMAJ; Family: TVS-Diodes; Bidirectional Channels: -; Applications: GeneralPurpose; Package Reference: SMA-2; Standard Package: 1; Package / Case: DO-214AC,SMA; Category: CircuitProtection; RoHS Information: SMAJSeriesMaterialDeclaration; Mounting Technology: SurfaceMount; Capacitance @ Frequency: -; Packaging: Digi-Reel®; Mounting Type: SurfaceMount
F1-F4 = CMP-07400-000017-1: PTC RESET FUSE 15V 100MA 0805; Manufacturer: Bourns Inc.; Resistance: 1-7.5Ω; Value: 1-7.5Ω; Current Rating: 40A; Hold Current: 0.1A; Trip Current: 0.3A; Trip Time: 1.5s; Temperature: -40°C to +85°C; ComponentLink2Description: Datasheet; Lead Free: Yes; Ipc Land Pattern Name: CAPC215135X67; Device Class L1: Circuit Protection; Mouser Description: Resettable Fuses - PPTC 0.10A 15V 1ohm; Automotive: No; Octopart: https://octopart.com/mf-psmf010x-2-bourns-7483441; Manufacturer Part Number: MF-PSMF010X-2; RoHS: TRUE; Temperature Range High: +85°C; Digikey Description: PTC RESET FUSE 15V 100MA 0805; Device Class L3: unset; ComponentLink2URL: https://www.bourns.com/docs/Product-Datasheets/mfpsmf.pdf; Height: 0.85mm; Voltage Rating: 15V; Ambient Temperature Range Low: -40°C; Category: Fuse; Package: MF-PSMF; Temperature Range Low: -40°C; Device Class L2: PTC Resettable Fuses; Ambient Temperature Range High: +85°C
R1-R4 = CMP-2002-04124-1: Manufacturer: KOA Speer; Part Number: SG73S1ETTP1R0J
R21 R23-R25 = CMP-009-00017-7: Chip Resistor, 10 KOhm, +/- 1%, 01 W, -55 to 155 degC, 0603 (1608 Metric); Manufacturer: Yageo; Manufacturer Part Number: RC0603FR-0710KL; Manufacturer: Panasonic; Manufacturer Part Number: ERJ-3EKF1002V; Manufacturer Part Number: RC0603FR-1310KL; Manufacturer: Vishay; Manufacturer Part Number: CRCW060310K0FKEA; Voltage Rating: 50V; Power: 100mW; RoHS Compliant: True; Min Operating Temperature: -55°C; Pins: 2; Case/Package: 0603; Mounting Technology: SM; Max Operating Temperature: 155°C; Tolerance: 1%; Component Type: Resistors
R22 R26-R28 = CMP-009-00014-6: Chip Resistor, 1 KOhm, +/-1%, 0.1 W, -55 to 155 degC, 0603 (1608 Metric); Manufacturer: Yageo; Manufacturer Part Number: RC0603FR-071KL; Manufacturer: Panasonic; Manufacturer Part Number: ERJ-3EKF1001V; Manufacturer Part Number: RC0603FR-131KL; Power: 100mW; Tolerance: 1%; Voltage Rating: 50V; Mounting Technology: SM; Case/Package: 0603; Min Operating Temperature: -55°C; RoHS Compliant: True; Max Operating Temperature: 155°C; Pins: 2; Component Type: Resistors
U1 = CMP-0271-00006-3: Quad Low Power, Rail-to-Rail Input / Output Operational Amplifier, 2.7 to 6 V, 0 to 70 degC, 14-pin SOIC (D14), Green (RoHS & no Sb/Br); Manufacturer: Texas Instruments; Offset Drift(Typ)(uV/C): 2; Total Supply Voltage(Min)(+5V is 5, +/-5V is 10): 2.7; IIB(Max)(pA): 14000; CMRR(Min)(dB): 66; Iq per channel(Max)(mA): 0.575; Vn at 1kHz(Typ)(nV/rtHz): 11; Slew Rate(Typ)(V/us): 1.6; Number of Channels: 4; Sub Family: High Output Current Amplifier (>=50mA), Low Supply Voltage Amplifier (<=2.7V), Precision Amplifier; Total Supply Voltage(Max)(+5V is 5, +/-5V is 10): 6; ComponentLink3URL: http://www.ti.com/lit/ml/mpds177g/mpds177g.pdf; ComponentLink1Description: Manufacturer URL; PackageReference: D0014A; Vio (25C)(Max)(mV): 2; Mounting Technology: Surface Mount; PackageDescription: 14-Pin Plastic Small Outline, Body 8.65 x 3.9 mm, Pitch 1.27 mm; ComponentLink2Description: Datasheet; ComponentLink3Description: Package Specification; ComponentLink1URL: http://www.ti.com/; DatasheetVersion: SLOS220J; PartNumber: TLV2464CDR; Code_JEDEC: MS-012; PackageVersion: 4040047-5/M, 06/2011; ComponentLink2URL: http://www.ti.com/general/docs/lit/getliterature.tsp?genericPartNumber=TLV2464&fileType=pdf; Eco-Plan: Green (RoHS & no Sb/Br)
U8-U11 = CMP-04895-000287-1: IC CURR SENSE 1 CIRCUIT SOT23-5; Operating Supply Current: 260uA; -3db Bandwidth: 350kHz; Slew Rate: 2V/µs; Number of Circuits: 1; Input Offset Voltage (Vos): 100uV; Input Bias Current: 100nA; Mount: Surface Mount; Max Operating Temperature: 125°C; Packaging: Tape and Reel; Min Operating Temperature: -40°C; Case/Package: SOT-23-5; RoHS Compliant: Yes

## Sheet Main.SchDoc: DAC AD5391
size A3; Author: Carlos Renan; Address1: UFCG; Address2: Laboratório VIRTUS CC; Address3: Campina Grande, PB - Brasil; SheetNumber: 2; SheetTotal: 8; PROJECT: HAT RPi 4 - Phase Shifter Fotônico; VERSION: v1.0; DocumentRev: 01; SCH_SCALE: N/A
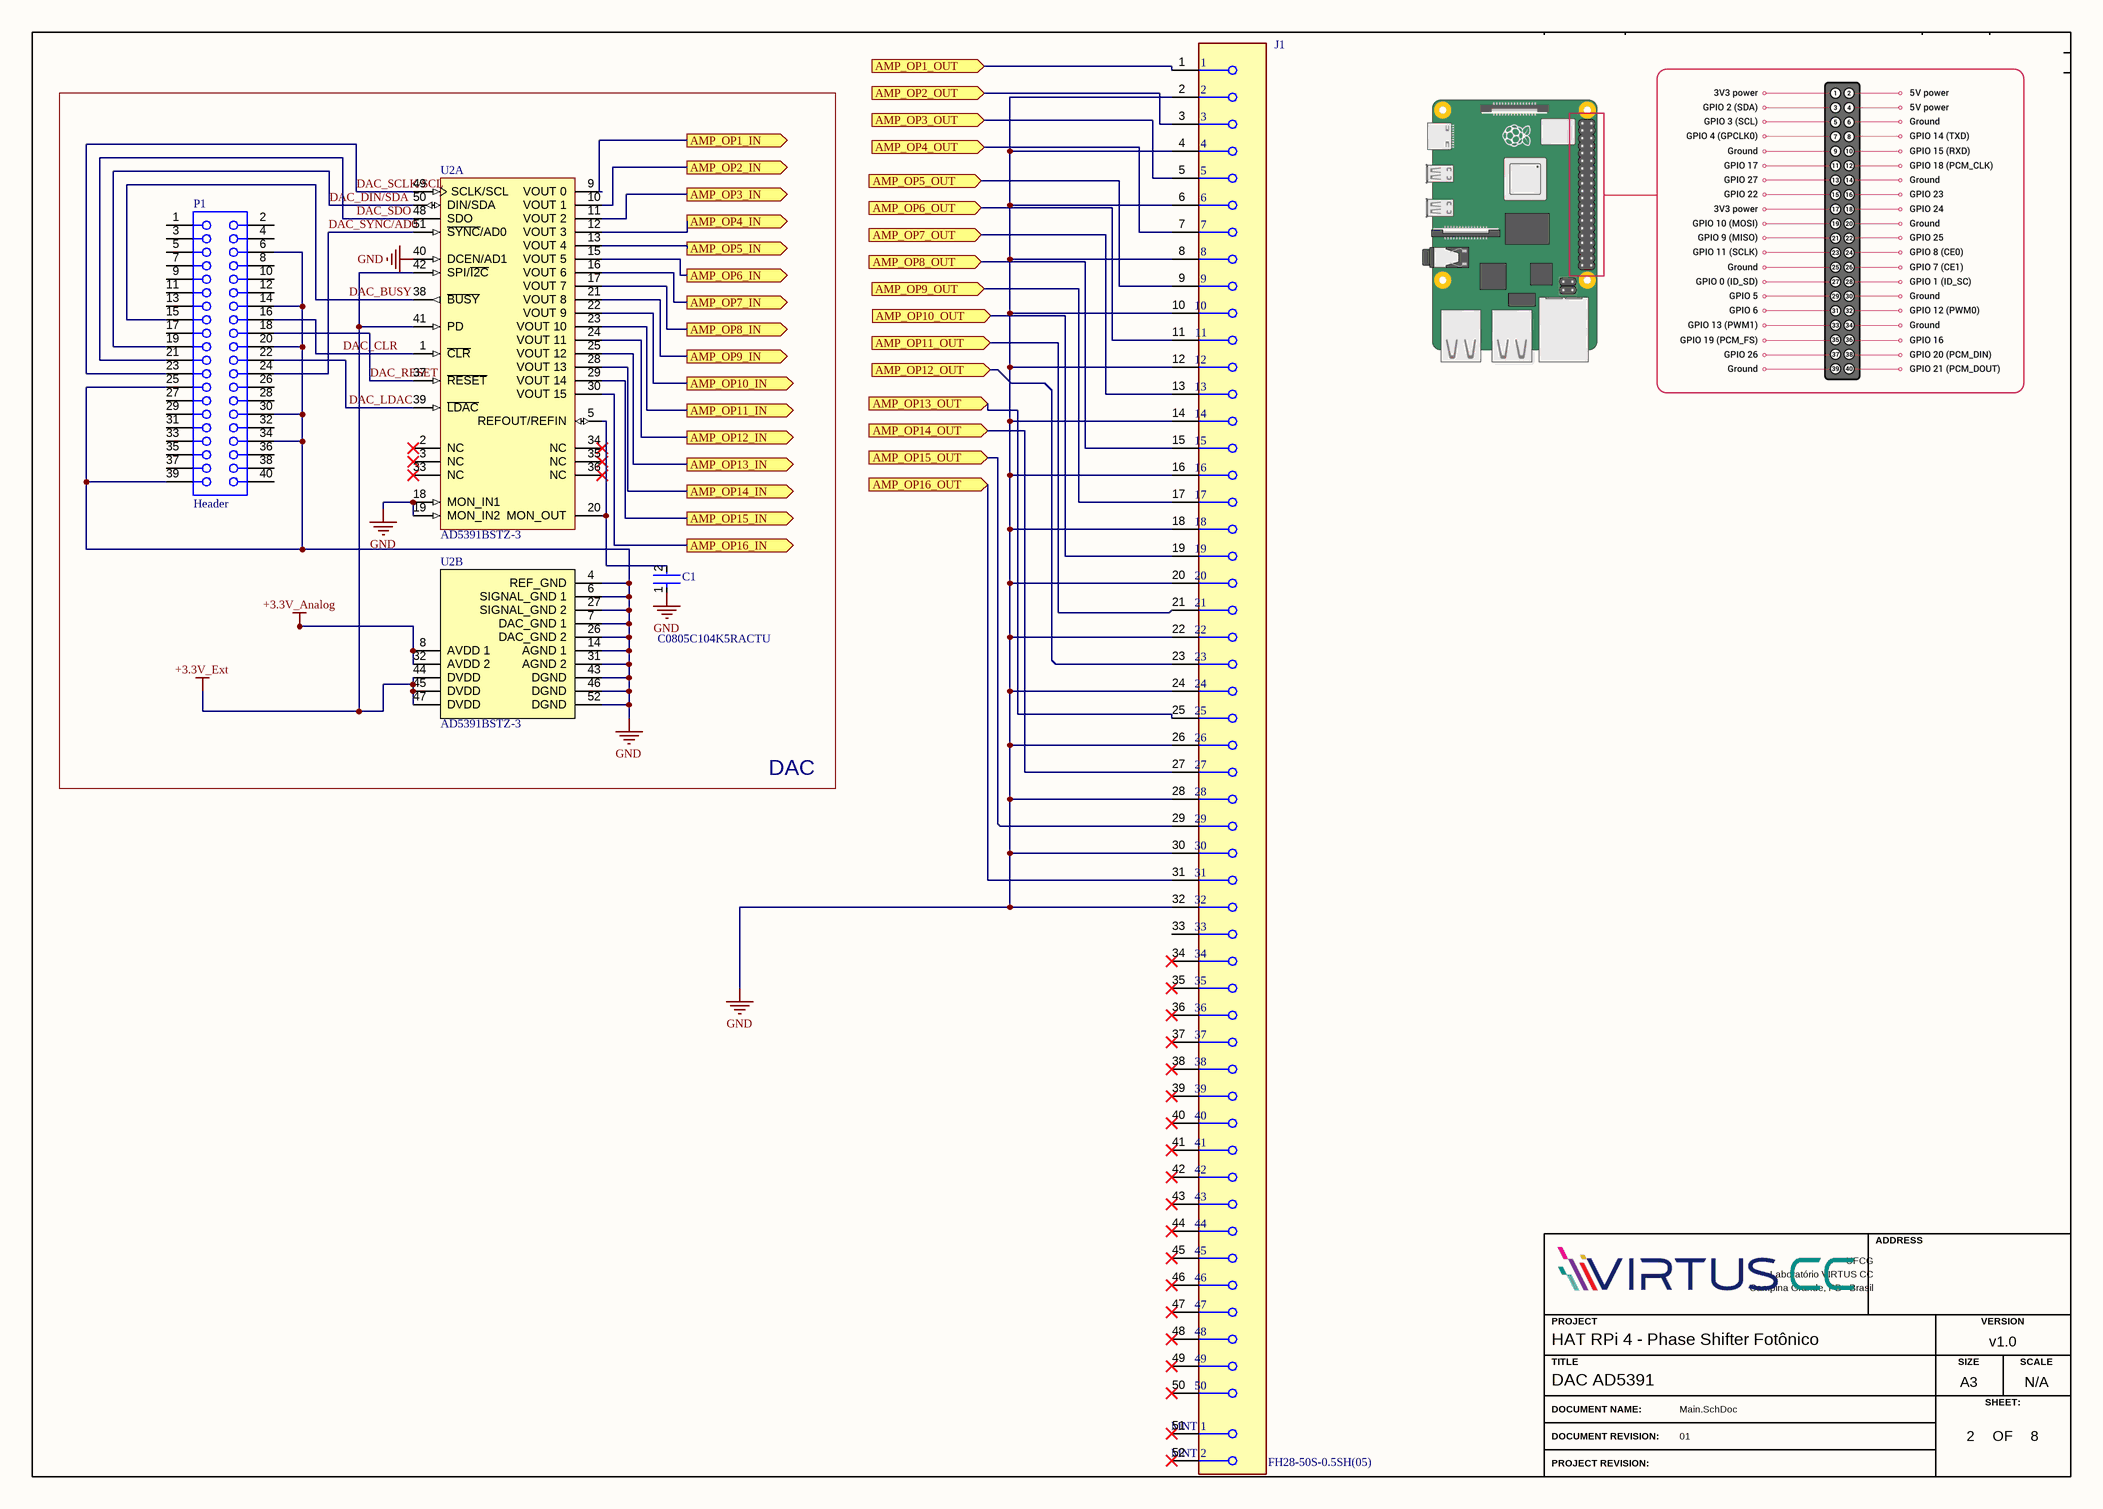
[diagram p3: Main.SchDoc]

### Parts
C1  C0805C104K5RACTU  [FP-C0805C-DN-MFG]
J1  FH28-50S-0.5SH(05)  [FP-FH28-50S-0_5SH_05-MFG]
P1  Header  [61204021621]
U2  AD5391BSTZ-3  [ST-52_L]  (parts A,B of 2)

### Blocks framed on the sheet
DAC: C1 P1 U2

### Ports
AMP_OP1_IN (out, see Amp_op1[2B]), AMP_OP1_OUT (in, see Amp_op1[6A]), AMP_OP2_IN (out, see Amp_op1[2B]), AMP_OP2_OUT (in, see Amp_op1[6B]), AMP_OP3_IN (out, see Amp_op1[2B]), AMP_OP3_OUT (in, see Amp_op1[6B]), AMP_OP4_IN (out, see Amp_op1[2B]), AMP_OP4_OUT (in, see Amp_op1[6C]), AMP_OP5_IN (out, see Amp_op2[1B]), AMP_OP5_OUT (in, see Amp_op2[6A]), AMP_OP6_IN (out, see Amp_op2[1B]), AMP_OP6_OUT (in, see Amp_op2[6B]), AMP_OP7_IN (out, see Amp_op2[1B]), AMP_OP7_OUT (in, see Amp_op2[6C]), AMP_OP8_IN (out, see Amp_op2[1B]), AMP_OP8_OUT (in, see Amp_op2[6C]), AMP_OP9_IN (out, see Amp_op3[2B]), AMP_OP9_OUT (in, see Amp_op3[6A]), AMP_OP10_IN (out, see Amp_op3[2B]), AMP_OP10_OUT (in, see Amp_op3[6B]), AMP_OP11_IN (out, see Amp_op3[2B]), AMP_OP11_OUT (in, see Amp_op3[6B]), AMP_OP12_IN (out, see Amp_op3[2B]), AMP_OP12_OUT (in, see Amp_op3[6C]), AMP_OP13_IN (out, see Amp_op4[2B]), AMP_OP13_OUT (in, see Amp_op4[6A]), AMP_OP14_IN (out, see Amp_op4[2B]), AMP_OP14_OUT (in, see Amp_op4[6B]), AMP_OP15_IN (out, see Amp_op4[2B]), AMP_OP15_OUT (in, see Amp_op4[6B]), AMP_OP16_IN (out, see Amp_op4[2B]), AMP_OP16_OUT (in, see Amp_op4[6C])

### Nets
+3.3V_Analog: U2.8(AVDD_1) U2.32(AVDD_2)
+3.3V_Ext: U2.41(PD) U2.42(SPI/~{I2C}) U2.44(DVDD) U2.45(DVDD) U2.47(DVDD)
GND: C1.1 J1.2 J1.4 J1.6 J1.8 J1.10 J1.12 J1.14 J1.16 J1.18 J1.20 J1.22 J1.24 J1.26 J1.28 J1.30 J1.32 P1.6 P1.14 P1.20 P1.25 P1.30 P1.34 P1.39 U2.4(REF_GND) U2.6(SIGNAL_GND_1) U2.7(DAC_GND_1) U2.14(AGND_1) U2.18(MON_IN1) U2.19(MON_IN2) U2.26(DAC_GND_2) U2.27(SIGNAL_GND_2) U2.31(AGND_2) U2.40(DCEN/AD1) U2.43(DGND) U2.46(DGND) U2.52(DGND)
CH1_VOUT_SENSE: J1.1 ; port AMP_OP1_OUT
CH2_VOUT_SENSE: J1.3 ; port AMP_OP2_OUT
CH3_VOUT_SENSE: J1.5 ; port AMP_OP3_OUT
CH4_VOUT_SENSE: J1.7 ; port AMP_OP4_OUT
CH5_VOUT_SENSE: J1.9 ; port AMP_OP5_OUT
CH6_VOUT_SENSE: J1.11 ; port AMP_OP6_OUT
CH7_VOUT_SENSE: J1.13 ; port AMP_OP7_OUT
CH8_VOUT_SENSE: J1.15 ; port AMP_OP8_OUT
CH9_VOUT_SENSE: J1.17 ; port AMP_OP9_OUT
CH10_VOUT_SENSE: J1.19 ; port AMP_OP10_OUT
CH11_VOUT_SENSE: J1.21 ; port AMP_OP11_OUT
CH12_VOUT_SENSE: J1.23 ; port AMP_OP12_OUT
CH13_VOUT_SENSE: J1.25 ; port AMP_OP13_OUT
CH14_VOUT_SENSE: J1.27 ; port AMP_OP14_OUT
CH15_VOUT_SENSE: J1.29 ; port AMP_OP15_OUT
CH16_VOUT_SENSE: J1.31 ; port AMP_OP16_OUT
DAC_BUSY: P1.15 U2.38(~{BUSY})
DAC_CLR: P1.16 U2.1(~{CLR})
DAC_DIN/SDA: P1.19 U2.50(DIN/SDA)
DAC_LDAC: P1.22 U2.39(~{LDAC})
DAC_RESET: P1.18 U2.37(~{RESET})
DAC_SCLK/SCL: P1.23 U2.49(SCLK/SCL)
DAC_SDO: P1.21 U2.48(SDO)
DAC_SYNC/AD0: P1.24 U2.51(~{SYNC}/AD0)
NetC1_2: C1.2 U2.5(REFOUT/REFIN) U2.20(MON_OUT)
NetR21_2: U2.9(VOUT_0) ; port AMP_OP1_IN
NetR23_1: U2.10(VOUT_1) ; port AMP_OP2_IN
NetR24_1: U2.11(VOUT_2) ; port AMP_OP3_IN
NetR25_1: U2.12(VOUT_3) ; port AMP_OP4_IN
NetR29_1: U2.13(VOUT_4) ; port AMP_OP5_IN
NetR31_1: U2.15(VOUT_5) ; port AMP_OP6_IN
NetR32_1: U2.16(VOUT_6) ; port AMP_OP7_IN
NetR33_1: U2.17(VOUT_7) ; port AMP_OP8_IN
NetR37_1: U2.21(VOUT_8) ; port AMP_OP9_IN
NetR39_1: U2.22(VOUT_9) ; port AMP_OP10_IN
NetR40_1: U2.23(VOUT_10) ; port AMP_OP11_IN
NetR41_1: U2.24(VOUT_11) ; port AMP_OP12_IN
NetR45_1: U2.25(VOUT_12) ; port AMP_OP13_IN
NetR47_1: U2.28(VOUT_13) ; port AMP_OP14_IN
NetR48_1: U2.29(VOUT_14) ; port AMP_OP15_IN
NetR49_1: U2.30(VOUT_15) ; port AMP_OP16_IN

Not connected (* = marked no-connect by the designer): J1 33 34* 35* 36* 37* 38* 39* 40* 41* 42* 43* 44* 45* 46* 47* 48* 49* 50* 51(MNT_1)* 52(MNT_2)*; P1 1 2 3 4 5 7 8 9 10 11 12 13 17 26 27 28 29 31 32 33 35 36 37 38 40; U2 2(NC)* 3(NC)* 33(NC)* 34(NC)* 35(NC)* 36(NC)*

### Notes on the sheet
- REVISION
- DESCRIPTION
- DATE
- APPROVED
- ADDRESS
- PROJECT
- VERSION
- TITLE
- A3
- SIZE
- SCALE
- DOCUMENT NAME:
- DOCUMENT REVISION:
- OF
- SHEET:
- PROJECT REVISION:

### Library data of the parts
C1 = CMP-2007-00279-2: CAP CER 0.1UF 50V X7R 0805; Manufacturer: KEMET; Value: 0.10 μF; Tolerance: 0.1; Temperature Coefficient: 30ppm/°C; Material: Ceramic; Manufacturer Part Number: C0805C104K5RACTU; Device Class L2: Capacitors; Temperature Range Low: -55°C; Voltage Rating: 50 V; Digikey Description: CAP CER 0.1UF 50V X7R 0805; Category: Cap; ComponentLink2Description: Datasheet; Octopart: https://octopart.com/c0805c104k5ractu-kemet-143926; RoHS: TRUE; ComponentLink2URL: https://content.kemet.com/datasheets/KEM_C1003_C0G_SMD.pdf; Temperature Characteristic: X7R; Temperature: -55°C to +125°C; Height: 0.88mm; Temperature Range High: +125°C; Device Class L1: Passive Components; Automotive: No; Lead Free: Yes; Ipc Land Pattern Name: CAPC200125X78; Device Class L3: Ceramic Capacitors; Mouser Description: Cap Ceramic 0.1uF 50V X7R 10% SMD 2.0 x 1.2 mm 125 C Paper T/R; Capacitance: 0.10 μF; Package: C0805C-DN
J1 = CMP-11609-000009-1: CONN FFC BOTTOM 50POS 0.50MM R/A; Manufacturer: Hirose Electric Co Ltd; Current Rating: 0.5A; Pitch: 0.5mm; Voltage Rating: 50V; Number Of Contacts: 50; Conn Gender: Female; Conn Orientation: Horizontal; Is Female: yes; ComponentLink2URL: http://www.hirose.co.jp/cataloge_hp/e58618038.pdf; Contact Material: Gold; Lead Free: Yes; Temperature: -40°C to +105°C; Digikey Description: CONN FFC BOTTOM 50POS 0.50MM R/A; Octopart: https://octopart.com/fh28-50s-0.5sh%2805%29-hirose-240232; Device Class L3: unset; RoHS: TRUE; Temperature Range High: +105°C; Height: 5.6mm; Device Class L1: Connectors; Package: 0; ComponentLink2Description: Datasheet; Automotive: No; Device Class L2: FFC / FPC; Category: Conn; Mouser Description: FFC & FPC Connectors 50POS 0.5MM SMT GOLD; Manufacturer Part Number: FH28-50S-0.5SH(05); Temperature Range Low: -40°C
P1 = CMP-1502-01370-4: THT Vertical Socket Header WR-PHD, Pitch 2.54 mm, Dual Row, 40 pins; Current Rating: 3A; Contact Resistance: 20mΩ; Gender: Female; Operating Supply Voltage: 250V; Lead Pitch: 2.54mm; Orientation: Vertical; Number of Pins: 40
U2 = CMP-0318-00791-2: 16 Channel 12-Bit Single-Supply Voltage Output Digital-to-Analog Converter with Serial Interface, 3 V, -40 to +85 degC, ST-52, Pb-Free, Tray; Manufacturer: Analog Devices; Generic Part Number: AD5391; Single Supply: Yes; Max V+: 5.5V; Resolution (Bits): 12; # DAC Outputs: 16; Settling Time: 6Âµs; Code_JEDEC: MS-026-BCC; Packing: Tray; PartNumber: AD5391BSTZ-3; ComponentLink5Description: Reference Design URL; DatasheetVersion: Rev. D; PackageVersion: 2003; Mounting Technology: Surface Mount; PackageReference: ST-52; ComponentLink3Description: Package Specification; ComponentLink5URL: http://www.analog.com/en/digital-to-analog-converters/da-converters/ad5391/products/product.html#prod_cross_sell; RevisionNote: Component URL fixed; ComponentLink3URL: http://www.analog.com/static/imported-files/packages/61012411624300842189414155189544791816408612ST_52_10x10.pdf; PackageDescription: 52-Lead Low Profile Quad Flat Package [LQFP]; RoHS: Y; ComponentLink4URL: http://www.analog.com/en/digital-to-analog-converters/da-converters/ad5391/products/product.html; ComponentLink4Description: Product URL; ComponentLink2URL: http://www.analog.com/static/imported-files/data_sheets/AD5390_5391_5392.pdf; ComponentLink1URL: http://www.analog.com/en/index.html; ComponentLink1Description: Manufacturer URL; ComponentLink2Description: Datasheet